# Altium schematic sheet Analog_mic_breakout.SchDoc
size A4; SheetNumber: 1; SheetTotal: 1
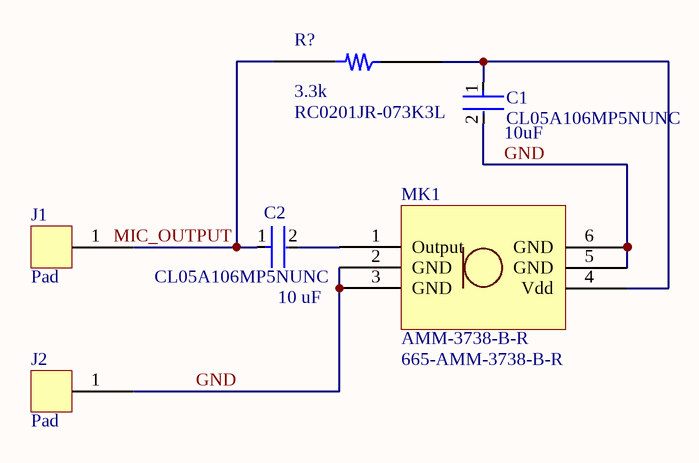
[diagram p0: Analog_mic_breakout.SchDoc]

## Parts
C1  CL05A106MP5NUNC  [FP-CL05A106MP5NUNC-MFG]
C2  CL05A106MP5NUNC  [FP-CL05A106MP5NUNC-MFG]
J1  Pad  [Pad]
J2  Pad  [Pad]
MK1  AMM-3738-B-R  [665-AMM-3738-B-R]
R?  RC0201JR-073K3L  [0603_SMD_Resistor]

## Nets
GND: C1.2 J2.1 MK1.2(GND) MK1.3(GND) MK1.5(GND) MK1.6(GND)
NetC1_1: C1.1 MK1.4(Vdd) R?.2
NetC2_1: C2.1 J1.1 R?.1
NetC2_2: C2.2 MK1.1(Output)

## Notes on the sheet
- (near C1) 10uF
- (near C2) 10 uF
- Labels drawn without touching a wire or pin: MIC_OUTPUT
- (in symbol RC0201JR-073K3L) 3.3k

## Library data of the parts
C1 C2 = CMP-13271-000002-1: CAP CER 10UF 10V X5R 0402; Manufacturer: Samsung; Temperature Coefficient: 15%; Tolerance: 20%; Material: Ceramic; Octopart: https://octopart.com/cl05a106mp5nunc-samsung-22457395; Voltage Rating: 10V; RoHS: TRUE; Value: 10uF; Height: 0.7mm; Digikey Description: CAP CER 10UF 10V X5R 0402; Automotive: No; Package: CL05A106MP5NUNC; Device Class L1: Passive Components; Capacitance: 10uF; Temperature Range High: +85°C; ComponentLink2Description: Datasheet; Device Class L2: Capacitors; Temperature Characteristic: X5R; Manufacturer Part Number: CL05A106MP5NUNC; Temperature: -55°C to +85°C; ComponentLink2URL: http://www.samsungsem.com/kr/support/product-search/mlcc/__icsFiles/afieldfile/2019/05/10/19-CL05A106MP5NUNC.pdf; Device Class L3: Ceramic Capacitors; Category: Cap; Temperature Range Low: -55°C; Ipc Land Pattern Name: CAPC10050X50; Lead Free: Yes
MK1 = AMM-3738-B-R: Manufacturer: PUI Audio; Supplier 1: Mouser; Supplier Part Number 1: 665-AMM-3738-B-R
R? = RC0201JR-073K3L: 3.3 kOhms ±5% 0.05W, 1/20W Chip Resistor 0201 (0603 Metric) Moisture Resistant Thick Film